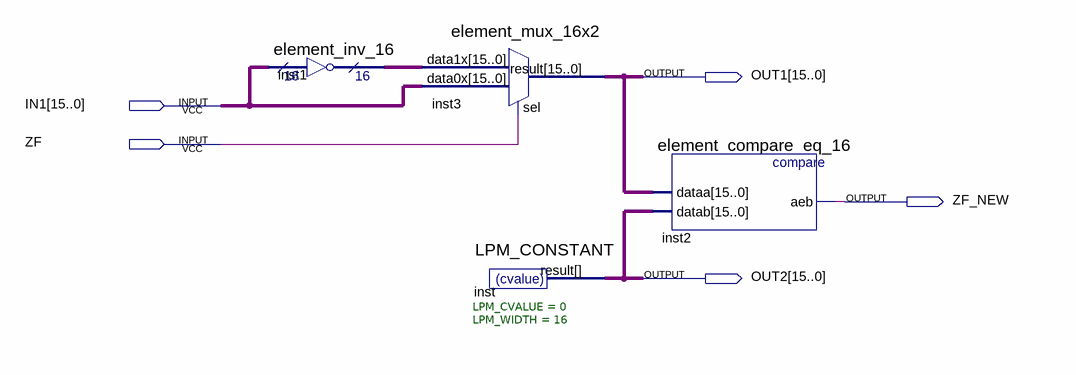
[diagram p0: schematic sheet]
// Quartus schematic block-operation-variant-notz.bdf as structural Verilog: 4 symbols, 5 pins
module \block-operation-variant-notz  (
  input  [15:0] IN1,
  input  ZF,
  output [15:0] OUT1,
  output ZF_NEW,
  output [15:0] OUT2
);

  wire [15:0] inst1_result;

  element_inv_16 inst1 (.data(IN1), .result(inst1_result));
  element_mux_16x2 inst3 (.data1x(inst1_result), .data0x(IN1), .sel(ZF), .result(OUT1));
  LPM_CONSTANT #(.LPM_CVALUE(0), .LPM_WIDTH(16)) inst (.result(OUT2));
  element_compare_eq_16 inst2 (.dataa(OUT1), .datab(OUT2), .aeb(ZF_NEW));
endmodule
